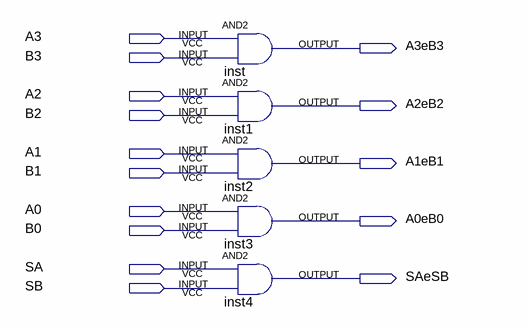
[diagram p0: schematic sheet]
// Quartus schematic AandB.bdf as structural Verilog: 5 symbols, 15 pins
module AandB (
  input  A3,
  input  B3,
  input  A2,
  input  B2,
  input  A1,
  input  B1,
  input  A0,
  input  B0,
  input  SA,
  input  SB,
  output A3eB3,
  output A2eB2,
  output A1eB1,
  output A0eB0,
  output SAeSB
);

  and inst (A3eB3, A3, B3);
  and inst1 (A2eB2, A2, B2);
  and inst2 (A1eB1, A1, B1);
  and inst3 (A0eB0, A0, B0);
  and inst4 (SAeSB, SA, SB);
endmodule
